# EAGLE design X15-ESC-Adapter (EAGLE 9.6.2)
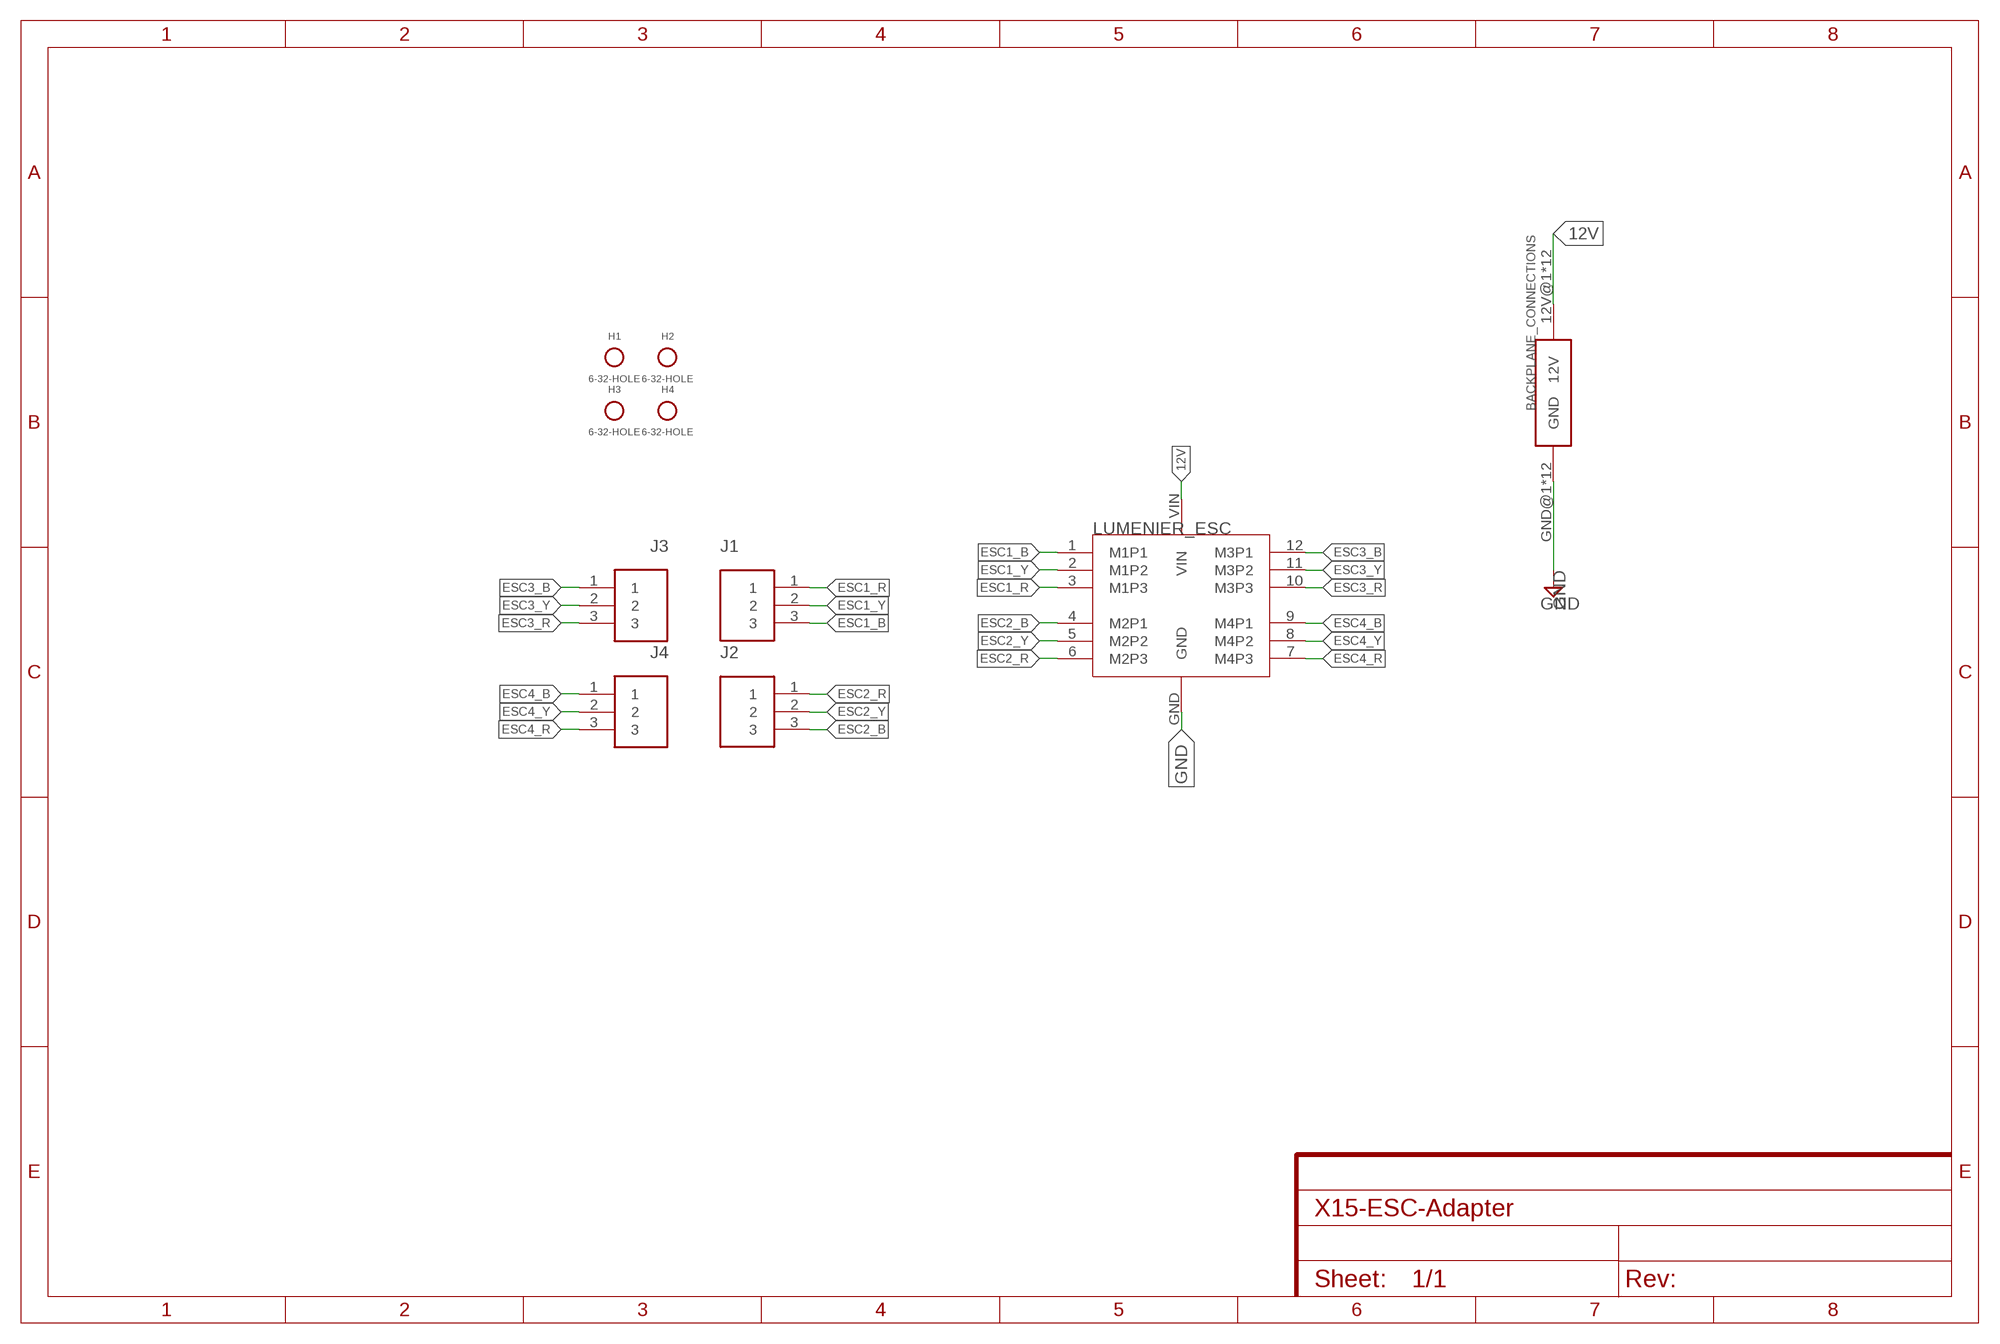
[diagram p0: schematic, sheet 1]

## Parts
BACKPLANE_CONNECTIONS  IPS1-112-01-L-D  [IPS1-BACKPLANE_ESC_ADAPTER_ESC_PWR]
H1  6-32-HOLE  [6-32-HOLE]
H2  6-32-HOLE  [6-32-HOLE]
H3  6-32-HOLE  [6-32-HOLE]
H4  6-32-HOLE  [6-32-HOLE]
J1  IBPT-103-H1-T-S-RA  [IPBT-103-H1-T-S-RA]
J2  IBPT-103-H1-T-S-RA  [IPBT-103-H1-T-S-RA]
J3  IBPT-103-H1-T-S-RA  [IPBT-103-H1-T-S-RA]
J4  IBPT-103-H1-T-S-RA  [IPBT-103-H1-T-S-RA]
LUMENIER_ESC  LUMENIER  [LUMENIER]

## Nets
12V: BACKPLANE_CONNECTIONS.12V@1(12V) BACKPLANE_CONNECTIONS.12V@2(12V) BACKPLANE_CONNECTIONS.12V@3(12V) BACKPLANE_CONNECTIONS.12V@4(12V) BACKPLANE_CONNECTIONS.12V@5(12V) BACKPLANE_CONNECTIONS.12V@6(12V) BACKPLANE_CONNECTIONS.12V@7(12V) BACKPLANE_CONNECTIONS.12V@8(12V) BACKPLANE_CONNECTIONS.12V@9(12V) BACKPLANE_CONNECTIONS.12V@10(12V) BACKPLANE_CONNECTIONS.12V@11(12V) BACKPLANE_CONNECTIONS.12V@12(12V) LUMENIER_ESC.VIN
ESC1_B: J1.3 LUMENIER_ESC.1(M1P1)
ESC1_R: J1.1 LUMENIER_ESC.3(M1P3)
ESC1_Y: J1.2 LUMENIER_ESC.2(M1P2)
ESC2_B: J2.3 LUMENIER_ESC.4(M2P1)
ESC2_R: J2.1 LUMENIER_ESC.6(M2P3)
ESC2_Y: J2.2 LUMENIER_ESC.5(M2P2)
ESC3_B: J3.1 LUMENIER_ESC.12(M3P1)
ESC3_R: J3.3 LUMENIER_ESC.10(M3P3)
ESC3_Y: J3.2 LUMENIER_ESC.11(M3P2)
ESC4_B: J4.1 LUMENIER_ESC.9(M4P1)
ESC4_R: J4.3 LUMENIER_ESC.7(M4P3)
ESC4_Y: J4.2 LUMENIER_ESC.8(M4P2)
GND: BACKPLANE_CONNECTIONS.GND@1(GND) BACKPLANE_CONNECTIONS.GND@2(GND) BACKPLANE_CONNECTIONS.GND@3(GND) BACKPLANE_CONNECTIONS.GND@4(GND) BACKPLANE_CONNECTIONS.GND@5(GND) BACKPLANE_CONNECTIONS.GND@6(GND) BACKPLANE_CONNECTIONS.GND@7(GND) BACKPLANE_CONNECTIONS.GND@8(GND) BACKPLANE_CONNECTIONS.GND@9(GND) BACKPLANE_CONNECTIONS.GND@10(GND) BACKPLANE_CONNECTIONS.GND@11(GND) BACKPLANE_CONNECTIONS.GND@12(GND) LUMENIER_ESC.GND

## Library data of the parts
BACKPLANE_CONNECTIONS = X15-ESC-Adapter:IPS1-112-01-L-D
H1-H4 = X15-ESC-Adapter:6-32-HOLE
J1-J4 = X15-ESC-Adapter:IBPT-103-H1-T-S-RA
LUMENIER_ESC = X15-ESC-Adapter:LUMENIER

## Board
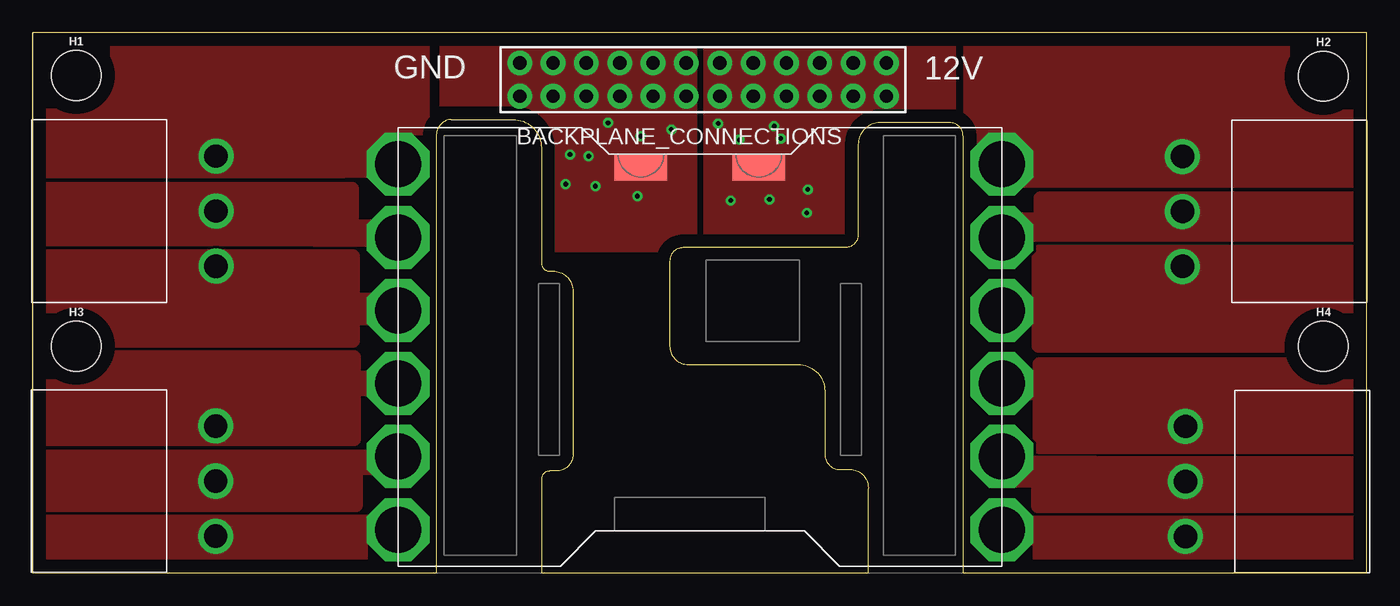
[diagram p1: board, top side]
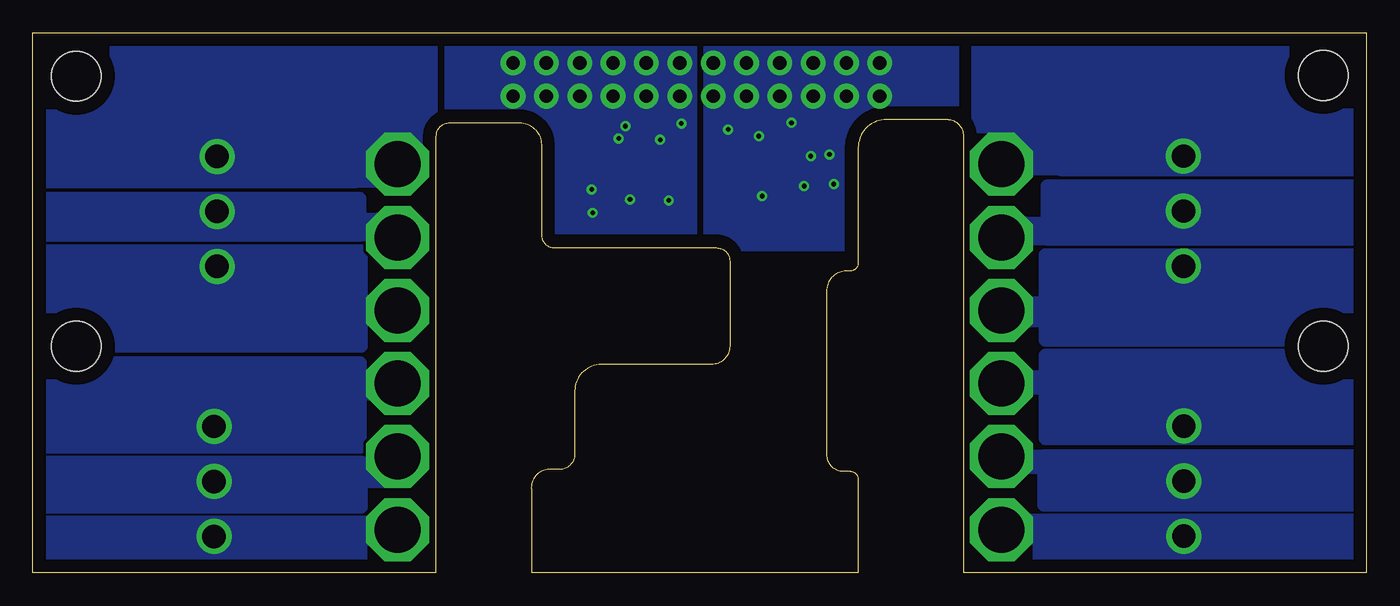
[diagram p2: board, bottom side, seen from below]

Size 101.6 x 41.15 mm. Coordinates in mm from the lower left corner, seen from the top.
Outline: 0,0 30.73,0 30.73,33.27 arc-90 31.88,34.54 36.58,34.54 arc-90 38.73,32.38 38.73,23.62 arc90 39.37,22.99 39.62,22.99 arc-90 41.15,21.46 41.15,9.02 arc-90 39.88,7.75 39.37,7.75 arc90 38.73,7.11 38.73,0 63.63,0 63.63,6.35 arc100 62.1,7.87 61.47,7.87 arc-90 60.33,9.02 60.33,13.84 arc90 58.29,15.88 49.91,15.88 arc-90 48.51,17.27 48.51,23.75 arc-90 49.53,24.77 61.85,24.77 arc90 62.87,25.78 62.87,32.64 arc-90 64.52,34.29 69.85,34.29 arc-90 70.87,33.27 70.87,0 101.6,0 101.6,41.15 0,41.15 0,0
Copper layers (1*16): Top 0.035mm / dielectric 1.5mm / Bottom 0.035mm
Design rules "477": minimum track width 6mil, minimum drill 0.35mm, track to track 6mil, track to pad 6mil, pad to pad 6mil, via to via 6mil, smd to smd 6mil, copper to edge 40mil, drill to drill 6mil, minimum pad ring 10mil, minimum via ring 8mil, stop-mask expansion 4mil, vias tented up to drill 0mil, thermal gap 10mil

### Footprints (pad centres in the part's own frame; a part is rotated, then mirrored left to right if it is on the bottom)
IPS1-BACKPLANE_ESC_ADAPTER_ESC_PWR = drill 1.016 pad 1.88: 12V@1 65.024,36.322; 12V@2 65.024,38.862; 12V@3 62.484,36.322; 12V@4 62.484,38.862; 12V@5 59.944,36.322; 12V@6 59.944,38.862; 12V@7 57.404,36.322; 12V@8 57.404,38.862; 12V@9 54.864,36.322; 12V@10 54.864,38.862; 12V@11 52.324,36.322; 12V@12 52.324,38.862; GND@1 49.784,38.862; GND@2 49.784,36.322; GND@3 47.244,38.862; GND@4 47.244,36.322; GND@5 44.704,38.862; GND@6 44.704,36.322; GND@7 42.164,38.862; GND@8 42.164,36.322; GND@9 39.624,38.862; GND@10 39.624,36.322; GND@11 37.084,38.862; GND@12 37.084,36.322
6-32-HOLE = hole 3.81: 0,0
IPBT-103-H1-T-S-RA = drill 1.778 pad 2.54: 1 -4.191,-3.747; 2 0,-3.747; 3 4.191,-3.747
LUMENIER = drill 3.5 pad 4.8 octagon: 1 0,30.62; 2 0,25.05; 3 0,19.48; 4 0,13.92; 5 0,8.35; 6 0,2.78; 7 46,2.78; 8 46,8.35; 9 46,13.92; 10 46,19.48; 11 46,25.05; 12 46,30.62 | smd 4 x 2: GND 18.51,30.37; VIN 27.49,30.37

### Placement (x,y rotation side)
BACKPLANE_CONNECTIONS  0,0 0 top
H1  3.3,37.9 0 top
H2  98.3,37.85 0 top
H3  3.3,17.27 0 top
H4  98.3,17.27 0 top
J1  10.21,27.56 90 top
J2  10.19,6.99 90 top
J3  91.31,27.53 270 top
J4  91.54,6.96 270 top
LUMENIER_ESC  27.81,0.51 0 top

### Tracks (layer width: path | path; a pad name or v marks a point on that pad's centre or on a via)
12V  (via drill 0.35)
  other vias: 52.2,34.24 56.46,34.04 53.82,32.99 56.97,33.1 59.03,29.21 58.95,27.43 56.11,28.45 53.16,28.37
  pour Top (isolate 0.203, no thermals): 51.59,44.32 51.59,25.15 69.8,25.15 69.8,44.32
  pour Bottom (isolate 0.203, no thermals): 51.49,45.47 51.49,25.27 69.72,25.27 69.72,45.47
ESC1_B
  pour Top (isolate 0.203, no thermals): -0.66,42.01 -0.66,30.58 23.62,30.58 23.62,33.83 29.72,33.83 29.72,42.01
  pour Bottom (isolate 0.203, no thermals): -0.97,42.29 29.62,42.29 29.62,34.01 23.27,34.01 23.27,30.71 -0.97,30.71
  pour Bottom (no thermals): 20.85,30.33 27.58,30.33 27.58,34.34 20.85,34.34
  pour Top (no thermals): 20.75,30.18 27.48,30.18 27.48,34.09 20.75,34.09
  pour Bottom (no thermals): 28.63,31.22 28.63,37.95 26.87,37.95 26.87,31.22
  pour Top (no thermals): 28.68,31.11 28.68,37.85 27.08,37.85 27.08,31.11
ESC1_R
  pour Top (isolate 0.203, no thermals): -1.09,24.12 24.41,24.12 24.41,17.68 -1.09,17.68
  pour Bottom (isolate 0.203, no thermals): -2.49,24.21 -2.49,17.73 24.46,17.73 24.46,24.21
  pour Bottom (no thermals): 21.16,18.77 27.76,18.77 27.76,21.03 21.16,21.03
  pour Top (no thermals): 21.23,18.97 27.97,18.97 27.97,21.23 21.23,21.23
ESC1_Y
  pour Top (isolate 0.203, no thermals): -2.21,29.26 24.31,29.26 24.31,25.37 -2.21,25.37
  pour Bottom (isolate 0.203, no thermals): -2.36,29.46 -2.36,25.43 24.33,25.43 24.33,29.46
  pour Bottom (no thermals): 21.23,24.99 27.97,24.99 27.97,27.08 21.23,27.08
  pour Top (no thermals): 21.34,24.94 28.07,24.94 28.07,26.85 21.34,26.85
ESC2_B
  pour Top (isolate 0.203, no thermals): -1.88,16.43 -1.88,10.16 24.46,10.16 24.46,16.43
  pour Bottom (isolate 0.203, no thermals): -2.72,16.56 -2.72,10.24 24.46,10.24 24.46,16.56
  pour Bottom (no thermals): 21.21,13.61 27.94,13.61 27.94,15.37 21.21,15.37
  pour Top (no thermals): 21.26,13.54 27.99,13.54 27.99,15.29 21.26,15.29
ESC2_R
  pour Bottom (isolate 0.203, no thermals): -3.3,4.01 -3.3,-1.07 24.94,-1.07 24.94,4.01
  pour Top (isolate 0.203, no thermals): -2.79,3.91 -2.79,-1.7 24.99,-1.7 24.99,3.91
  pour Bottom (no thermals): 21.16,2.69 27.89,2.69 27.89,4.45 21.16,4.45
  pour Top (no thermals): 21.01,2.59 27.74,2.59 27.74,4.34 21.01,4.34
ESC2_Y
  pour Top (isolate 0.203, no thermals): -1.12,8.86 -1.12,5.13 24.61,5.13 24.61,8.86
  pour Bottom (isolate 0.203, no thermals): 24.59,8.89 24.59,5.18 -3.02,5.18 -3.02,8.89
  pour Bottom (no thermals): 21.08,7.57 27.81,7.57 27.81,9.32 21.08,9.32
  pour Top (no thermals): 21.16,7.54 27.89,7.54 27.89,9.3 21.16,9.3
ESC3_B
  pour Top (isolate 0.203, no thermals): 71.37,42.44 71.37,32.79 77.06,32.79 77.06,29.84 103.23,29.84 103.23,42.44
  pour Bottom (isolate 0.203, no thermals): 71.27,43.13 71.27,32.89 77.04,32.89 77.04,29.82 103.33,29.82 103.33,43.13
  pour Bottom (no thermals): 73.81,29.39 80.54,29.39 80.54,33.58 73.81,33.58
  pour Top (no thermals): 73.71,29.41 80.44,29.41 80.44,33.32 73.71,33.32
  pour Bottom (no thermals): 74.63,31.09 74.63,37.82 72.87,37.82 72.87,31.09
  pour Top (no thermals): 74.83,30.99 74.83,37.72 72.92,37.72 72.92,30.99
ESC3_R
  pour Top (isolate 0.203, no thermals): 103.15,24.46 76.61,24.46 76.61,17.27 103.15,17.27
  pour Bottom (isolate 0.203, no thermals): 76.61,24.51 76.61,17.3 104.88,17.3 104.88,24.51
  pour Bottom (no thermals): 73.84,18.87 80.57,18.87 80.57,20.95 73.84,20.95
  pour Top (no thermals): 73.86,18.92 80.59,18.92 80.59,21.01 73.86,21.01
ESC3_Y
  pour Top (isolate 0.203, no thermals): 76.76,28.55 102.74,28.55 102.74,25.73 76.76,25.73
  pour Bottom (isolate 0.203, no thermals): 76.71,28.52 76.71,25.73 103.1,25.73 103.1,28.52
  pour Bottom (no thermals): 73.86,25.3 80.59,25.3 80.59,27.38 73.86,27.38
  pour Top (no thermals): 73.79,25.3 80.72,25.3 80.72,27.38 73.79,27.38
ESC4_B
  pour Top (isolate 0.203, no thermals): 103.63,15.93 103.63,9.55 76.66,9.55 76.66,15.93
  pour Bottom (isolate 0.203, no thermals): 76.66,15.98 76.66,9.6 104.75,9.6 104.75,15.98
  pour Bottom (no thermals): 73.81,13.21 80.54,13.21 80.54,15.29 73.81,15.29
  pour Top (no thermals): 73.84,13.26 80.57,13.26 80.57,15.34 73.84,15.34
ESC4_R
  pour Top (isolate 0.203, no thermals): 76.66,3.84 103.89,3.84 103.89,-2.29 76.66,-2.29
  pour Bottom (isolate 0.203, no thermals): 76.63,3.86 76.63,-2.13 105.28,-2.13 105.28,3.86
  pour Bottom (no thermals): 73.63,2.21 80.37,2.21 80.37,4.29 73.63,4.29
  pour Top (no thermals): 73.53,2.18 80.26,2.18 80.26,4.27 73.53,4.27
ESC4_Y
  pour Top (isolate 0.203, no thermals): 76.57,8.38 76.57,5.08 103.84,5.08 103.84,8.38
  pour Bottom (isolate 0.203, no thermals): 76.61,8.41 76.61,5.03 105.11,5.03 105.11,8.41
  pour Bottom (no thermals): 73.76,6.53 81,6.53 81,8.84 73.76,8.84
  pour Top (no thermals): 73.63,6.58 81.03,6.58 81.03,8.81 73.63,8.81
GND  (via drill 0.35)
  other vias: 42.34,31.75 42.85,29.46 40.59,29.62 46.05,28.7 40.92,31.88 43.81,34.29 46.3,33.27 48.64,33.78
  pour Top (isolate 0.203, no thermals): 31.5,42.7 50.11,42.7 50.11,24.94 31.5,24.94
  pour Bottom (isolate 0.203, no thermals): 31.55,42.93 31.55,24.99 50.01,24.99 50.01,42.93

### Text on the board
tNames: GND | 12V